# Altium project Psat Payload.PrjPcb
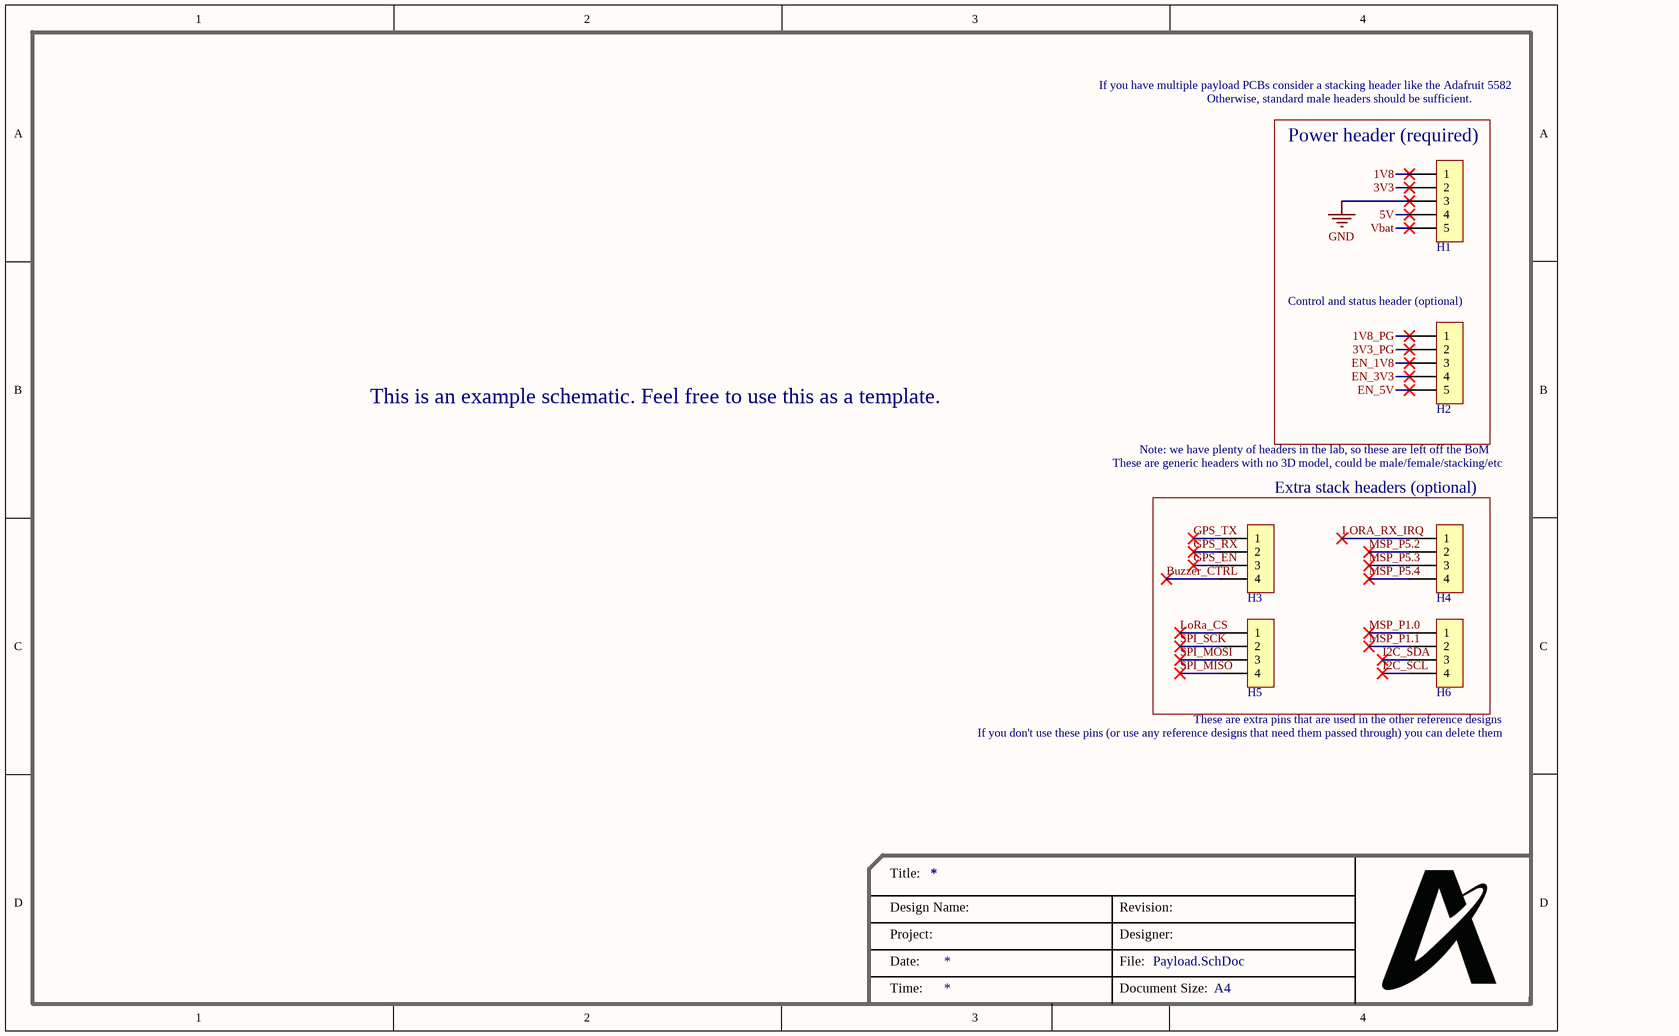
[diagram p0: Payload.SchDoc]
1 sheet, 6 parts. Net scope: hierarchical (ports join the sheet entries above them; power ports are global).
Board file: Payload.PcbDoc

## Sheet Payload.SchDoc
size A4

### Parts
H1  Header - 2.54mm,1x5-pin  [HEADER_2.54MM_1x5PIN]  (value not drawn)  (no BOM)
H2  Header - 2.54mm,1x5-pin  [HEADER_2.54MM_1x5PIN]  (value not drawn)  (no BOM)
H3  Header - 2.54mm,1x4-pin  [HEADER_2.54MM_1x4PIN]  (value not drawn)  (no BOM)
H4  Header - 2.54mm,1x4-pin  [HEADER_2.54MM_1x4PIN]  (value not drawn)  (no BOM)
H5  Header - 2.54mm,1x4-pin  [HEADER_2.54MM_1x4PIN]  (value not drawn)  (no BOM)
H6  Header - 2.54mm,1x4-pin  [HEADER_2.54MM_1x4PIN]  (value not drawn)  (no BOM)

### Blocks framed on the sheet
Power header (required): H1 H2
Extra stack headers (optional): H3-H6

### Nets
GND: H1.3
1V8: H1.1
1V8_PG: H2.1
3V3: H1.2
3V3_PG: H2.2
5V: H1.4
Buzzer_CTRL: H3.4
EN_1V8: H2.3
EN_3V3: H2.4
EN_5V: H2.5
GPS_EN: H3.3
GPS_RX: H3.2
GPS_TX: H3.1
I2C_SCL: H6.4
I2C_SDA: H6.3
LoRa_CS: H5.1
LORA_RX_IRQ: H4.1
MSP_P1.0: H6.1
MSP_P1.1: H6.2
MSP_P5.2: H4.2
MSP_P5.3: H4.3
MSP_P5.4: H4.4
SPI_MISO: H5.4
SPI_MOSI: H5.3
SPI_SCK: H5.2
Vbat: H1.5

### Notes on the sheet
- If you have multiple payload PCBs consider a stacking header like the Adafruit 5582
- Otherwise, standard male headers should be sufficient.
- (near H2) Control and status header (optional)
- This is an example schematic. Feel free to use this as a template.
- These are generic headers with no 3D model, could be male/female/stacking/etc
- Note: we have plenty of headers in the lab, so these are left off the BoM
- If you don't use these pins (or use any reference designs that need them passed through) you can delete them
- These are extra pins that are used in the other reference designs
- Title:
- Design Name:
- Revision:
- Project:
- Date:
- Designer:
- File:
- Time:
- Document Size:
- A4